# Altium schematic sheet MidEthernet.SchDoc
size A4
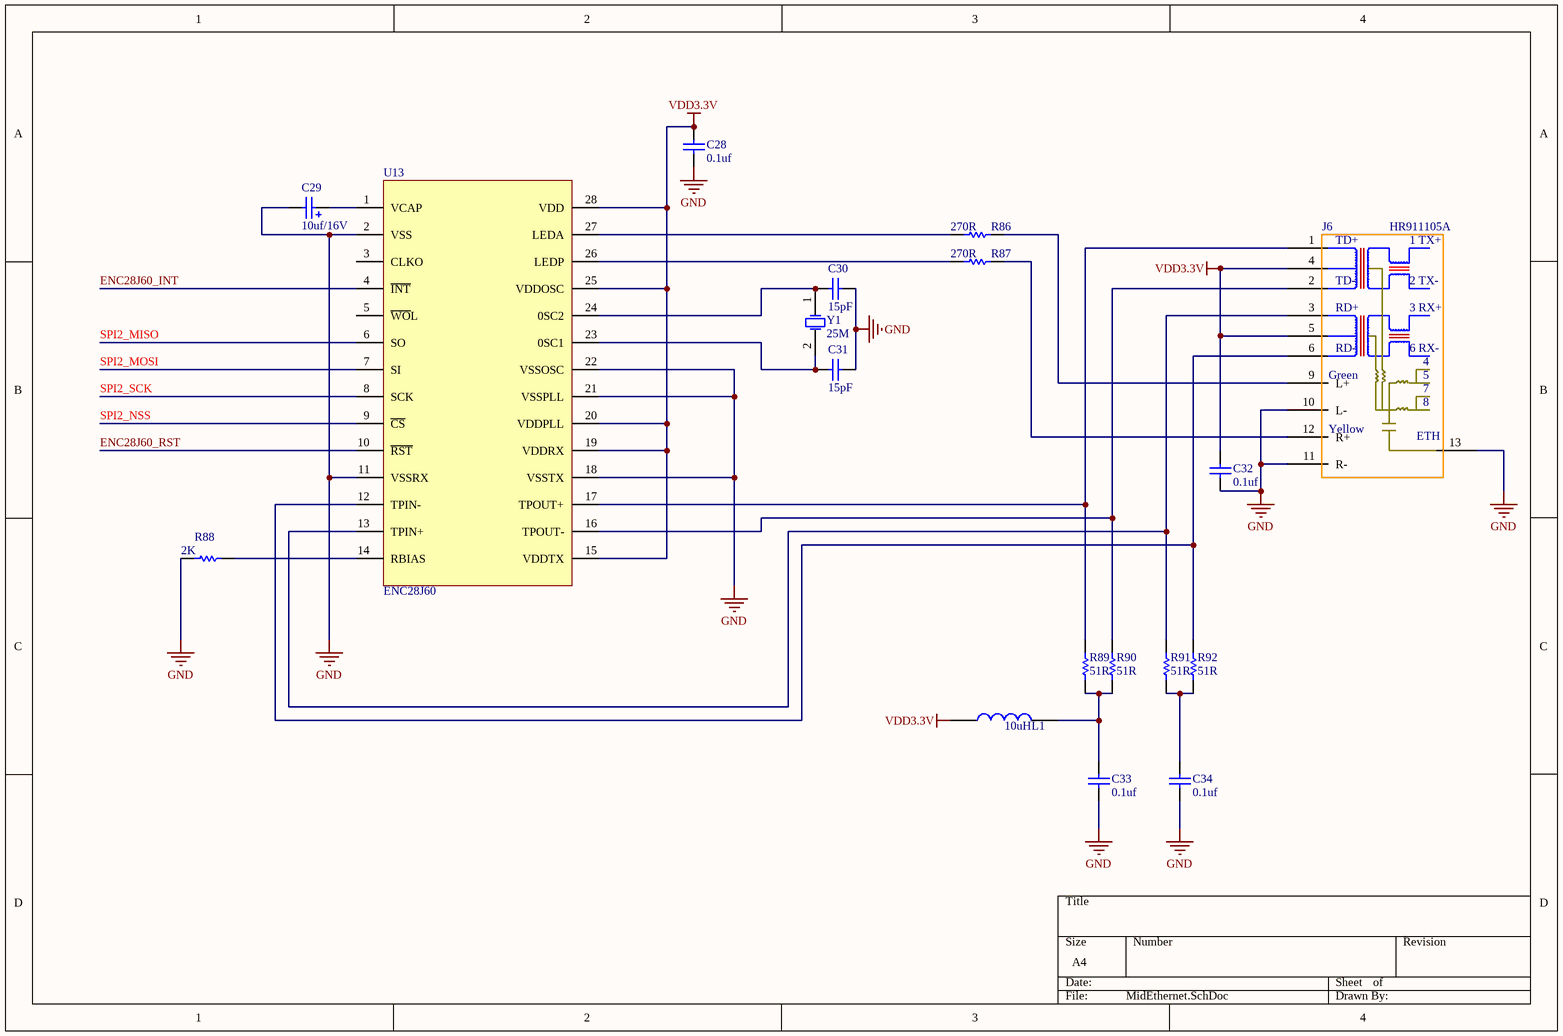
[diagram p0: MidEthernet.SchDoc]

## Parts
C28  value 0.1uf  [C0805]  (hidden comment: Cap)
C29  value 10uf/16V  [C3216]
C30  value 15pF  [C0805]  (hidden comment: Cap)
C31  value 15pF  [C0805]  (hidden comment: Cap)
C32  value 0.1uf  [C0805]  (hidden comment: Cap)
C33  value 0.1uf  [C0805]  (hidden comment: Cap)
C34  value 0.1uf  [C0805]  (hidden comment: Cap)
J6  HR911105A  [HR911105A]
L1  10uH  [INDM4532N]
R86  value 270R  [0805]  (hidden comment: Res Semi)
R87  value 270R  [0805]  (hidden comment: Res Semi)
R88  value 2K  [0805]  (hidden comment: Res Semi)
R89  value 51R  [0805]  (hidden comment: Res Semi)
R90  value 51R  [0805]  (hidden comment: Res Semi)
R91  value 51R  [0805]  (hidden comment: Res Semi)
R92  value 51R  [0805]  (hidden comment: Res Semi)
U13  ENC28J60  [SSOP28]
Y1  XTAL  [CY]  (value not drawn)

## Nets
GND: C28.1 C29.2 C30.1 C31.1 C32.1 C33.1 C34.1 J6.10(L-) J6.11(R-) J6.13 R88.2 U13.2(VSS) U13.11(VSSRX) U13.18(VSSTX) U13.21(VSSPLL) U13.22(VSSOSC)
VDD3.3V: C28.2 C32.2 J6.4 J6.5 L1.1 U13.15(VDDTX) U13.19(VDDRX) U13.20(VDDPLL) U13.25(VDDOSC) U13.28(VDD)
ENC28J60_INT: U13.4(~{INT})
ENC28J60_RST: U13.10(~{RST})
SPI2_MISO: U13.6(SO)
SPI2_MOSI: U13.7(SI)
SPI2_NSS: U13.9(~{CS})
SPI2_SCK: U13.8(SCK)
NetC29_1: C29.1 U13.1(VCAP)
NetC30_2: C30.2 U13.24(0SC2) Y1.1(OSC1)
NetC31_2: C31.2 U13.23(0SC1) Y1.2(OSC2)
NetC33_2: C33.2 L1.2 R89.2 R90.2
NetC34_2: C34.2 R91.2 R92.2
NetJ6_1: J6.1 R89.1 U13.17(TPOUT+)
NetJ6_2: J6.2 R90.1 U13.16(TPOUT-)
NetJ6_3: J6.3 R91.1 U13.13(TPIN+)
NetJ6_6: J6.6 R92.1 U13.12(TPIN-)
NetJ6_9: J6.9(L+) R86.1
NetJ6_12: J6.12(R+) R87.1
NetR86_2: R86.2 U13.27(LEDA)
NetR87_2: R87.2 U13.26(LEDP)
NetR88_1: R88.1 U13.14(RBIAS)

Not connected (* = marked no-connect by the designer): U13 3(CLKO) 5(~{WO}L)

## Notes on the sheet
- (in symbol HR911102) TD+; 1 TX+; TD-; 2 TX-; RD+; 3 RX+; RD-; 6 RX-; Green; 7; 8; Yellow; ETH
- (in symbol XTAL) 25M

## Library data of the parts
C28 C32-C34 = Cap: Capacitor; Manufacturer: Generic Components; Class: Passive; Published: 08/06/2000; Publisher: Altium Hobart Technology Centre; SubClass: Capacitor
C29 = Cap Pol2: Polarized Capacitor (Axial); Published: 8-Jun-2000; LatestRevisionDate: 17-Jul-2002; LatestRevisionNote: Re-released for DXP Platform.; PackageReference: POLAR0.8; Publisher: Altium Limited; PackageDescription: Polarized Capacitor; 2 Leads
C30 C31 = Cap: Capacitor; Published: 8-Jun-2000; LatestRevisionDate: 17-Jul-2002; LatestRevisionNote: Re-released for DXP Platform.; PackageReference: RAD-0.3; Publisher: Altium Limited
J6 = HR911102
L1 = INDUCTOR
R86-R92 = Res Semi: Semiconductor Resistor; Published: 8-Jun-2000; LatestRevisionDate: 17-Jul-2002; LatestRevisionNote: Re-released for DXP Platform.; PackageReference: AXIAL-0.5; Publisher: Altium Limited
Y1 = XTAL: Crystal Oscillator; Published: 8-Jun-2000; LatestRevisionDate: 17-Jul-2002; LatestRevisionNote: Re-released for DXP Platform.; PackageReference: R38; Publisher: Altium Limited